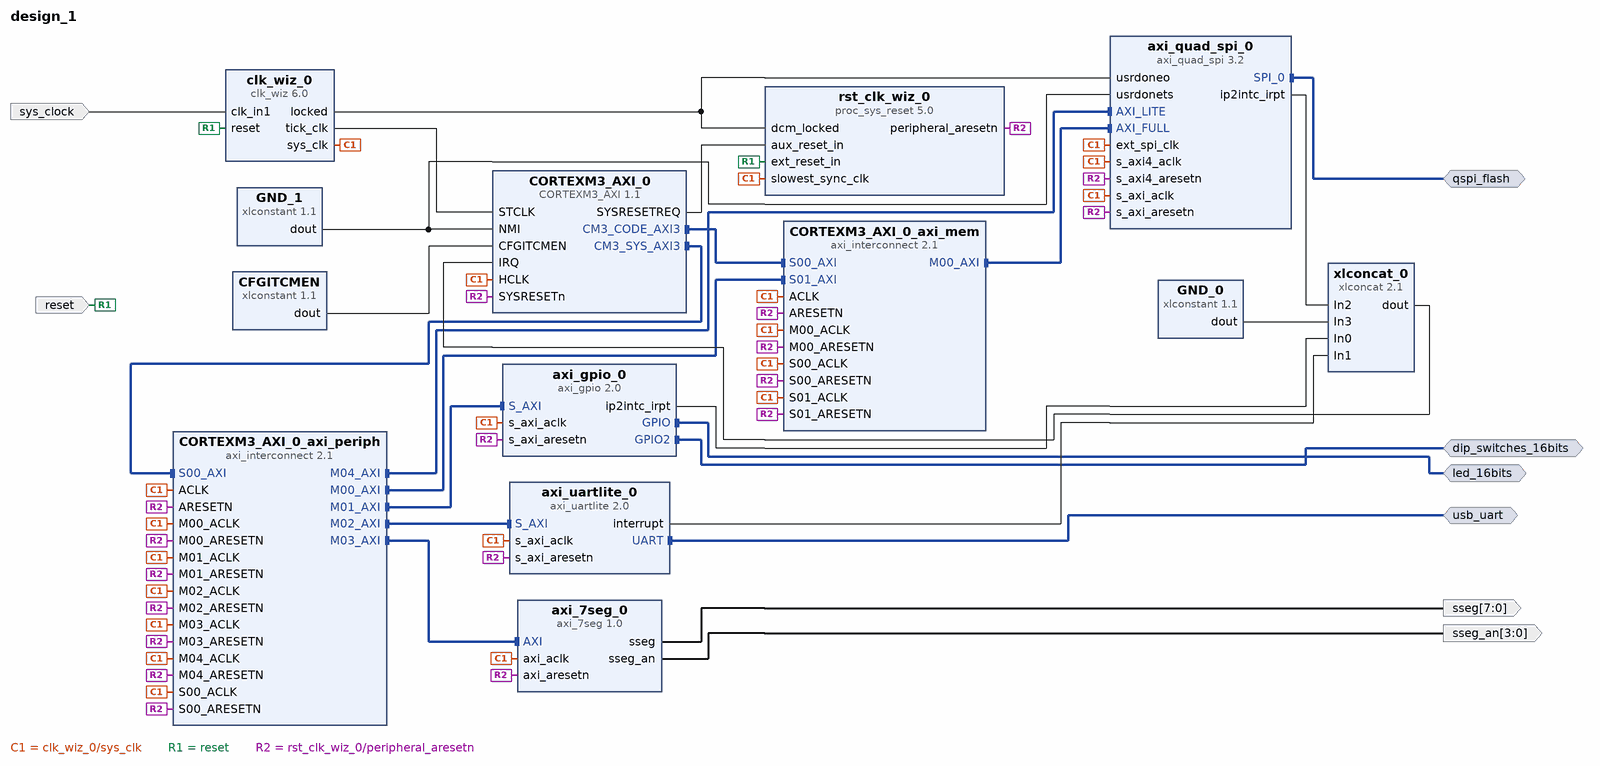
[diagram p0: block diagram of the top level]
# Vivado block design design_1, xc7a35tcpg236-1, Vivado 2021.1
create_bd_design design_1

create_bd_intf_port -mode Master -vlnv xilinx.com:interface:uart_rtl:1.0 usb_uart
create_bd_intf_port -mode Master -vlnv xilinx.com:interface:gpio_rtl:1.0 led_16bits
create_bd_intf_port -mode Master -vlnv xilinx.com:interface:gpio_rtl:1.0 dip_switches_16bits
create_bd_intf_port -mode Master -vlnv xilinx.com:interface:spi_rtl:1.0 qspi_flash
create_bd_port -dir I -type clk sys_clock
set_property -dict {CONFIG.FREQ_HZ 100000000 CONFIG.PHASE 0.0} [get_bd_ports sys_clock]
create_bd_port -dir I -type rst reset
set_property -dict {CONFIG.POLARITY ACTIVE_HIGH} [get_bd_ports reset]
create_bd_port -dir O -from 3 -to 0 sseg_an
create_bd_port -dir O -from 7 -to 0 sseg

create_bd_cell -type ip -vlnv Arm.com:CortexM:CORTEXM3_AXI:1.1 CORTEXM3_AXI_0
set_property -dict [list \
  CONFIG.BB_PRESENT true \
  CONFIG.DEBUG_LVL 0 \
  CONFIG.ITCM_INIT_FILE /home/joao/Development/artix-soc/software/bin/v1.artix_soc_cm3.mem \
  CONFIG.JTAG_PRESENT false \
  CONFIG.MPU_PRESENT false \
  CONFIG.TRACE_LVL 0 \
] [get_bd_cells CORTEXM3_AXI_0]
create_bd_cell -type ip -vlnv xilinx.com:ip:clk_wiz:6.0 clk_wiz_0
set_property -dict [list \
  CONFIG.CLKOUT1_JITTER 171.042 \
  CONFIG.CLKOUT1_PHASE_ERROR 128.132 \
  CONFIG.CLKOUT1_REQUESTED_OUT_FREQ 50 \
  CONFIG.CLKOUT2_JITTER 270.159 \
  CONFIG.CLKOUT2_PHASE_ERROR 128.132 \
  CONFIG.CLKOUT2_REQUESTED_OUT_FREQ 5 \
  CONFIG.CLKOUT2_USED true \
  CONFIG.CLK_IN1_BOARD_INTERFACE sys_clock \
  CONFIG.CLK_OUT1_PORT sys_clk \
  CONFIG.CLK_OUT2_PORT tick_clk \
  CONFIG.MMCM_CLKFBOUT_MULT_F 6.250 \
  CONFIG.MMCM_CLKIN1_PERIOD 10.000 \
  CONFIG.MMCM_CLKIN2_PERIOD 10.000 \
  CONFIG.MMCM_CLKOUT0_DIVIDE_F 12.500 \
  CONFIG.MMCM_CLKOUT1_DIVIDE 125 \
  CONFIG.MMCM_DIVCLK_DIVIDE 1 \
  CONFIG.NUM_OUT_CLKS 2 \
  CONFIG.RESET_BOARD_INTERFACE reset \
  CONFIG.USE_BOARD_FLOW true \
] [get_bd_cells clk_wiz_0]
create_bd_cell -type ip -vlnv xilinx.com:ip:axi_uartlite:2.0 axi_uartlite_0
set_property -dict [list \
  CONFIG.C_BAUDRATE 115200 \
  CONFIG.UARTLITE_BOARD_INTERFACE usb_uart \
  CONFIG.USE_BOARD_FLOW true \
] [get_bd_cells axi_uartlite_0]
create_bd_cell -type ip -vlnv xilinx.com:ip:axi_gpio:2.0 axi_gpio_0
set_property -dict [list \
  CONFIG.C_INTERRUPT_PRESENT 1 \
  CONFIG.GPIO2_BOARD_INTERFACE dip_switches_16bits \
  CONFIG.GPIO_BOARD_INTERFACE led_16bits \
  CONFIG.USE_BOARD_FLOW true \
] [get_bd_cells axi_gpio_0]
create_bd_cell -type ip -vlnv xilinx.com:ip:axi_interconnect:2.1 CORTEXM3_AXI_0_axi_periph
set_property -dict {CONFIG.NUM_MI 5} [get_bd_cells CORTEXM3_AXI_0_axi_periph]
create_bd_cell -type ip -vlnv xilinx.com:ip:proc_sys_reset:5.0 rst_clk_wiz_0
set_property -dict {CONFIG.C_AUX_RESET_HIGH 1} [get_bd_cells rst_clk_wiz_0]
create_bd_cell -type ip -vlnv xilinx.com:ip:xlconstant:1.1 GND_0
set_property -dict {CONFIG.CONST_VAL 0 CONFIG.CONST_WIDTH 13} [get_bd_cells GND_0]
create_bd_cell -type ip -vlnv xilinx.com:ip:xlconcat:2.1 xlconcat_0
set_property -dict [list \
  CONFIG.IN0_WIDTH 1 \
  CONFIG.IN1_WIDTH 1 \
  CONFIG.IN2_WIDTH 1 \
  CONFIG.IN3_WIDTH 13 \
  CONFIG.NUM_PORTS 4 \
] [get_bd_cells xlconcat_0]
create_bd_cell -type ip -vlnv xilinx.com:ip:xlconstant:1.1 GND_1
set_property -dict {CONFIG.CONST_VAL 0} [get_bd_cells GND_1]
create_bd_cell -type ip -vlnv xilinx.com:ip:xlconstant:1.1 CFGITCMEN
set_property -dict {CONFIG.CONST_WIDTH 2} [get_bd_cells CFGITCMEN]
create_bd_cell -type ip -vlnv user.org:user:axi_7seg:1.0 axi_7seg_0
create_bd_cell -type ip -vlnv xilinx.com:ip:axi_quad_spi:3.2 axi_quad_spi_0
set_property -dict [list \
  CONFIG.C_SHARED_STARTUP 1 \
  CONFIG.C_SPI_MEMORY 2 \
  CONFIG.C_SPI_MODE 1 \
  CONFIG.C_TYPE_OF_AXI4_INTERFACE 1 \
  CONFIG.C_XIP_MODE 1 \
  CONFIG.C_XIP_PERF_MODE 1 \
  CONFIG.QSPI_BOARD_INTERFACE qspi_flash \
  CONFIG.USE_BOARD_FLOW true \
] [get_bd_cells axi_quad_spi_0]
create_bd_cell -type ip -vlnv xilinx.com:ip:axi_interconnect:2.1 CORTEXM3_AXI_0_axi_mem
set_property -dict [list \
  CONFIG.NUM_MI 1 \
  CONFIG.NUM_SI 2 \
  CONFIG.S00_HAS_DATA_FIFO 2 \
  CONFIG.S01_HAS_DATA_FIFO 2 \
  CONFIG.STRATEGY 2 \
] [get_bd_cells CORTEXM3_AXI_0_axi_mem]

# ---- connections ----

connect_bd_intf_net [get_bd_intf_pins CORTEXM3_AXI_0/CM3_SYS_AXI3] [get_bd_intf_pins CORTEXM3_AXI_0_axi_periph/S00_AXI]
connect_bd_intf_net [get_bd_intf_pins CORTEXM3_AXI_0_axi_mem/M00_AXI] [get_bd_intf_pins axi_quad_spi_0/AXI_FULL]
connect_bd_intf_net [get_bd_intf_pins CORTEXM3_AXI_0_axi_periph/M01_AXI] [get_bd_intf_pins axi_gpio_0/S_AXI]
connect_bd_intf_net [get_bd_intf_pins CORTEXM3_AXI_0_axi_periph/M02_AXI] [get_bd_intf_pins axi_uartlite_0/S_AXI]
connect_bd_intf_net [get_bd_intf_pins CORTEXM3_AXI_0_axi_periph/M03_AXI] [get_bd_intf_pins axi_7seg_0/AXI]
connect_bd_intf_net [get_bd_intf_pins axi_quad_spi_0/AXI_LITE] [get_bd_intf_pins CORTEXM3_AXI_0_axi_periph/M04_AXI]
connect_bd_intf_net [get_bd_intf_pins CORTEXM3_AXI_0_axi_mem/S00_AXI] [get_bd_intf_pins CORTEXM3_AXI_0/CM3_CODE_AXI3]
connect_bd_intf_net [get_bd_intf_pins CORTEXM3_AXI_0_axi_mem/S01_AXI] [get_bd_intf_pins CORTEXM3_AXI_0_axi_periph/M00_AXI]
connect_bd_intf_net [get_bd_intf_ports led_16bits] [get_bd_intf_pins axi_gpio_0/GPIO]
connect_bd_intf_net [get_bd_intf_ports dip_switches_16bits] [get_bd_intf_pins axi_gpio_0/GPIO2]
connect_bd_intf_net [get_bd_intf_ports qspi_flash] [get_bd_intf_pins axi_quad_spi_0/SPI_0]
connect_bd_intf_net [get_bd_intf_ports usb_uart] [get_bd_intf_pins axi_uartlite_0/UART]
connect_bd_net [get_bd_pins CFGITCMEN/dout] [get_bd_pins CORTEXM3_AXI_0/CFGITCMEN]
connect_bd_net [get_bd_pins CORTEXM3_AXI_0/SYSRESETREQ] [get_bd_pins rst_clk_wiz_0/aux_reset_in]
connect_bd_net [get_bd_pins GND_0/dout] [get_bd_pins xlconcat_0/In3]
connect_bd_net [get_bd_pins GND_1/dout] [get_bd_pins CORTEXM3_AXI_0/NMI] [get_bd_pins axi_quad_spi_0/usrdonets]
connect_bd_net [get_bd_pins axi_7seg_0/sseg] [get_bd_ports sseg]
connect_bd_net [get_bd_pins axi_7seg_0/sseg_an] [get_bd_ports sseg_an]
connect_bd_net [get_bd_pins axi_gpio_0/ip2intc_irpt] [get_bd_pins xlconcat_0/In0]
connect_bd_net [get_bd_pins axi_quad_spi_0/ip2intc_irpt] [get_bd_pins xlconcat_0/In2]
connect_bd_net [get_bd_pins axi_uartlite_0/interrupt] [get_bd_pins xlconcat_0/In1]
connect_bd_net -net clk_wiz_0_clk_out1 [get_bd_pins clk_wiz_0/sys_clk] \
  [get_bd_pins CORTEXM3_AXI_0/HCLK] [get_bd_pins CORTEXM3_AXI_0_axi_periph/S00_ACLK] \
  [get_bd_pins rst_clk_wiz_0/slowest_sync_clk] [get_bd_pins axi_gpio_0/s_axi_aclk] \
  [get_bd_pins CORTEXM3_AXI_0_axi_periph/M00_ACLK] [get_bd_pins CORTEXM3_AXI_0_axi_periph/ACLK] \
  [get_bd_pins axi_uartlite_0/s_axi_aclk] [get_bd_pins CORTEXM3_AXI_0_axi_periph/M01_ACLK] \
  [get_bd_pins CORTEXM3_AXI_0_axi_periph/M02_ACLK] [get_bd_pins axi_7seg_0/axi_aclk] [get_bd_pins axi_quad_spi_0/s_axi_aclk] \
  [get_bd_pins CORTEXM3_AXI_0_axi_periph/M03_ACLK] [get_bd_pins axi_quad_spi_0/s_axi4_aclk] \
  [get_bd_pins CORTEXM3_AXI_0_axi_periph/M04_ACLK] [get_bd_pins CORTEXM3_AXI_0_axi_mem/ACLK] \
  [get_bd_pins CORTEXM3_AXI_0_axi_mem/S00_ACLK] [get_bd_pins CORTEXM3_AXI_0_axi_mem/M00_ACLK] \
  [get_bd_pins CORTEXM3_AXI_0_axi_mem/S01_ACLK] [get_bd_pins axi_quad_spi_0/ext_spi_clk]
connect_bd_net [get_bd_pins clk_wiz_0/locked] [get_bd_pins rst_clk_wiz_0/dcm_locked] [get_bd_pins axi_quad_spi_0/usrdoneo]
connect_bd_net [get_bd_pins clk_wiz_0/tick_clk] [get_bd_pins CORTEXM3_AXI_0/STCLK]
connect_bd_net [get_bd_ports reset] [get_bd_pins clk_wiz_0/reset] [get_bd_pins rst_clk_wiz_0/ext_reset_in]
connect_bd_net -net rst_clk_wiz_0_100M_peripheral_aresetn [get_bd_pins rst_clk_wiz_0/peripheral_aresetn] \
  [get_bd_pins CORTEXM3_AXI_0/SYSRESETn] [get_bd_pins CORTEXM3_AXI_0_axi_periph/S00_ARESETN] \
  [get_bd_pins axi_gpio_0/s_axi_aresetn] [get_bd_pins CORTEXM3_AXI_0_axi_periph/M00_ARESETN] \
  [get_bd_pins CORTEXM3_AXI_0_axi_periph/ARESETN] [get_bd_pins axi_uartlite_0/s_axi_aresetn] \
  [get_bd_pins CORTEXM3_AXI_0_axi_periph/M01_ARESETN] [get_bd_pins CORTEXM3_AXI_0_axi_periph/M02_ARESETN] \
  [get_bd_pins axi_7seg_0/axi_aresetn] [get_bd_pins axi_quad_spi_0/s_axi_aresetn] \
  [get_bd_pins CORTEXM3_AXI_0_axi_periph/M03_ARESETN] [get_bd_pins axi_quad_spi_0/s_axi4_aresetn] \
  [get_bd_pins CORTEXM3_AXI_0_axi_periph/M04_ARESETN] [get_bd_pins CORTEXM3_AXI_0_axi_mem/S00_ARESETN] \
  [get_bd_pins CORTEXM3_AXI_0_axi_mem/ARESETN] [get_bd_pins CORTEXM3_AXI_0_axi_mem/M00_ARESETN] \
  [get_bd_pins CORTEXM3_AXI_0_axi_mem/S01_ARESETN]
connect_bd_net [get_bd_ports sys_clock] [get_bd_pins clk_wiz_0/clk_in1]
connect_bd_net [get_bd_pins xlconcat_0/dout] [get_bd_pins CORTEXM3_AXI_0/IRQ]

# ---- address map ----
assign_bd_address -offset 0x10000000 -range 1M -target_address_space [get_bd_addr_spaces CORTEXM3_AXI_0/CM3_CODE_AXI3] [get_bd_addr_segs axi_quad_spi_0/aximm/MEM0]
assign_bd_address -offset 0x10000000 -range 1M -target_address_space [get_bd_addr_spaces CORTEXM3_AXI_0/CM3_SYS_AXI3] [get_bd_addr_segs axi_quad_spi_0/aximm/MEM0]
assign_bd_address -offset 0x40000000 -range 4K -target_address_space [get_bd_addr_spaces CORTEXM3_AXI_0/CM3_SYS_AXI3] [get_bd_addr_segs axi_gpio_0/S_AXI/Reg]
assign_bd_address -offset 0x40001000 -range 4K -target_address_space [get_bd_addr_spaces CORTEXM3_AXI_0/CM3_SYS_AXI3] [get_bd_addr_segs axi_uartlite_0/S_AXI/Reg]
assign_bd_address -offset 0x40002000 -range 4K -target_address_space [get_bd_addr_spaces CORTEXM3_AXI_0/CM3_SYS_AXI3] [get_bd_addr_segs axi_7seg_0/AXI/REG]
assign_bd_address -offset 0x40003000 -range 4K -target_address_space [get_bd_addr_spaces CORTEXM3_AXI_0/CM3_SYS_AXI3] [get_bd_addr_segs axi_quad_spi_0/AXI_LITE/Reg]

validate_bd_design
save_bd_design
